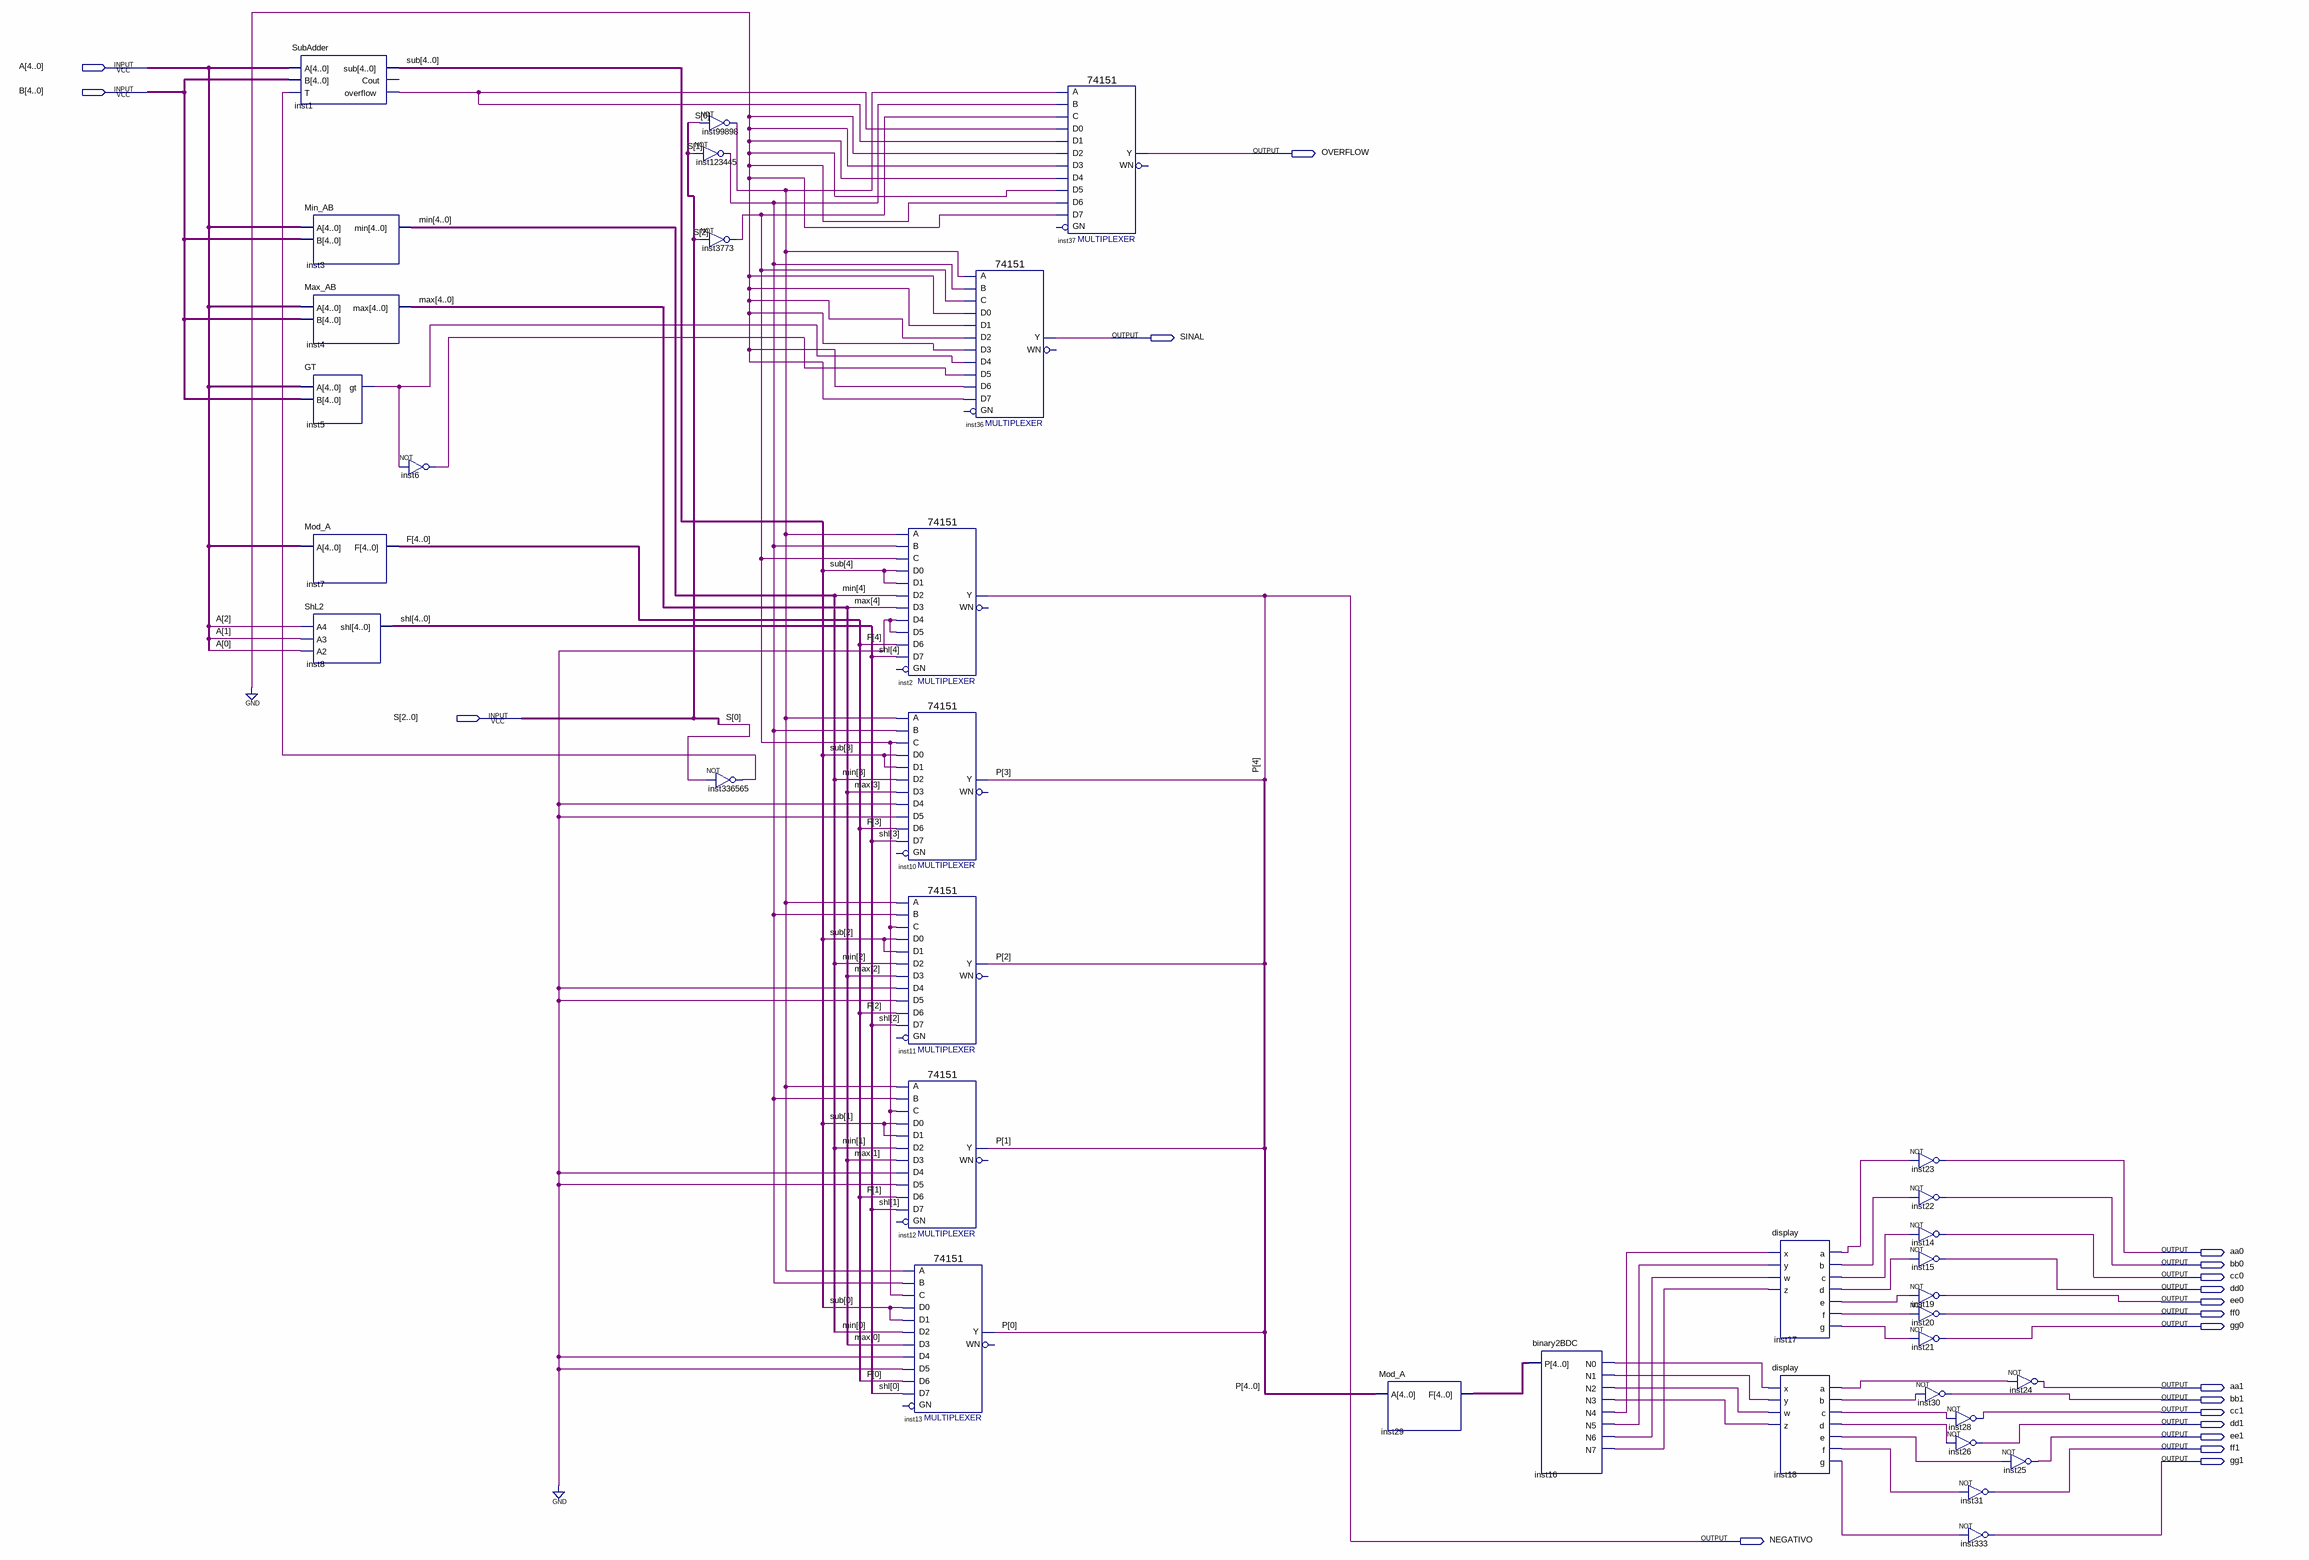
[diagram p0: schematic sheet]
// Quartus schematic ULA.bdf as structural Verilog: 36 symbols, 20 pins
module ULA (
  input  [4:0] A,
  input  [4:0] B,
  input  [2:0] S,
  output OVERFLOW,
  output SINAL,
  output aa0,
  output bb0,
  output cc0,
  output dd0,
  output ee0,
  output ff0,
  output gg0,
  output aa1,
  output bb1,
  output cc1,
  output dd1,
  output ee1,
  output ff1,
  output gg1,
  output NEGATIVO
);

  wire inst1_overflow, inst5_gt, inst6_out, inst16_n0, inst16_n1, inst16_n2, inst16_n3, inst16_n4, inst16_n5,
       inst16_n6, inst16_n7, inst17_a, inst17_b, inst17_c, inst17_d, inst17_e, inst17_f, inst17_g, inst18_a,
       inst18_b, inst18_c, inst18_d, inst18_e, inst18_f, inst18_g, inst3773_out, inst99898_out,
       inst123445_out, inst336565_out;
  wire [3:0] P;
  wire [4:0] F, inst29_f, max, min, shl, sub;

  SubAdder inst1 (.A(A), .B(B), .T(inst336565_out), .sub(sub), .overflow(inst1_overflow));  // open: Cout
  Min_AB inst3 (.A(A), .B(B), .min(min));
  Max_AB inst4 (.A(A), .B(B), .max(max));
  GT inst5 (.A(A), .B(B), .gt(inst5_gt));
  Mod_A inst7 (.A(A), .F(F));
  ShL2 inst8 (.A4(A[2]), .A3(A[1]), .A2(A[0]), .shl(shl));
  not inst6 (inst6_out, inst5_gt);
  not inst99898 (inst99898_out, S[0]);
  not inst123445 (inst123445_out, S[1]);
  not inst3773 (inst3773_out, S[2]);
  not inst336565 (inst336565_out, S[0]);
  \74151  inst2 (
    .C(inst3773_out), .B(inst123445_out), .A(inst99898_out), .D5(1'b0), .D0(sub[4]), .D1(sub[4]), .D4(1'b0),
    .D3(max[4]), .D2(min[4]), .D6(F[4]), .D7(shl[4]), .Y(NEGATIVO));  // open: GN, WN
  \74151  inst10 (
    .C(inst3773_out), .B(inst123445_out), .A(inst99898_out), .D5(1'b0), .D0(sub[3]), .D1(sub[3]), .D4(1'b0),
    .D3(max[3]), .D2(min[3]), .D6(F[3]), .D7(shl[3]), .Y(P[3]));  // open: GN, WN
  \74151  inst11 (
    .C(inst3773_out), .B(inst123445_out), .A(inst99898_out), .D5(1'b0), .D0(sub[2]), .D1(sub[2]), .D4(1'b0),
    .D3(max[2]), .D2(min[2]), .D6(F[2]), .D7(shl[2]), .Y(P[2]));  // open: GN, WN
  \74151  inst12 (
    .C(inst3773_out), .B(inst123445_out), .A(inst99898_out), .D5(1'b0), .D0(sub[1]), .D1(sub[1]), .D4(1'b0),
    .D3(max[1]), .D2(min[1]), .D6(F[1]), .D7(shl[1]), .Y(P[1]));  // open: GN, WN
  \74151  inst13 (
    .C(inst3773_out), .B(inst123445_out), .A(inst99898_out), .D5(1'b0), .D0(sub[0]), .D1(sub[0]), .D4(1'b0),
    .D3(max[0]), .D2(min[0]), .D6(F[0]), .D7(shl[0]), .Y(P[0]));  // open: GN, WN
  \74151  inst36 (
    .C(inst3773_out), .B(inst123445_out), .A(inst99898_out), .D5(inst6_out), .D0(1'b0), .D1(1'b0),
    .D4(inst5_gt), .D3(1'b0), .D2(1'b0), .D6(1'b0), .D7(1'b0), .Y(SINAL));  // open: GN, WN
  \74151  inst37 (
    .C(inst3773_out), .B(inst123445_out), .A(inst99898_out), .D5(1'b0), .D0(inst1_overflow),
    .D1(inst1_overflow), .D4(1'b0), .D3(1'b0), .D2(1'b0), .D6(1'b0), .D7(1'b0), .Y(OVERFLOW));  // open: GN, WN
  Mod_A inst29 (.A({NEGATIVO, P}), .F(inst29_f));
  binary2BDC inst16 (
    .P(inst29_f), .N0(inst16_n0), .N1(inst16_n1), .N2(inst16_n2), .N3(inst16_n3), .N4(inst16_n4),
    .N5(inst16_n5), .N6(inst16_n6), .N7(inst16_n7));
  display inst17 (
    .x(inst16_n4), .y(inst16_n5), .w(inst16_n6), .z(inst16_n7), .a(inst17_a), .b(inst17_b), .c(inst17_c),
    .d(inst17_d), .e(inst17_e), .f(inst17_f), .g(inst17_g));
  display inst18 (
    .x(inst16_n0), .y(inst16_n1), .w(inst16_n2), .z(inst16_n3), .a(inst18_a), .b(inst18_b), .c(inst18_c),
    .d(inst18_d), .e(inst18_e), .f(inst18_f), .g(inst18_g));
  not inst23 (aa0, inst17_a);
  not inst22 (bb0, inst17_b);
  not inst14 (cc0, inst17_c);
  not inst15 (dd0, inst17_d);
  not inst19 (ee0, inst17_e);
  not inst20 (ff0, inst17_f);
  not inst21 (gg0, inst17_g);
  not inst30 (bb1, inst18_b);
  not inst28 (cc1, inst18_c);
  not inst26 (dd1, inst18_d);
  not inst25 (ee1, inst18_e);
  not inst31 (ff1, inst18_f);
  not inst333 (gg1, inst18_g);
  not inst24 (aa1, inst18_a);

  // Other names for the same wires on the sheet: P[4] = NEGATIVO
endmodule
